# EAGLE schematic single_horz_wth_para (EAGLE 9.3.0)
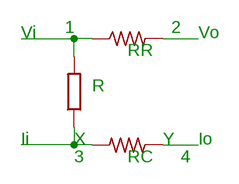
[diagram p0: schematic, sheet 1]

## Parts
R  R-EU_0204/2V  [0204V]
RC  R-US_0204/2V  [0204V]
RR  R-US_0204/2V  [0204V]

## Nets
II: R.1 RC.2
N$1: RC.1
VI: R.2 RR.1
VO: RR.2

## Notes on the sheet
- 1 | 2
- Vi | Vo
- RR
- R
- Ii | X | Y | Io
- 3 | RC | 4

## Library data of the parts
R = resistor:R-EU_: RESISTOR, European symbol
RC RR = resistor:R-US_: RESISTOR, American symbol